# Altium schematic sheet Schematic.SchDoc: PCB_Winch
size A4; DrawnBy: Andres Tosca; Revision: 4
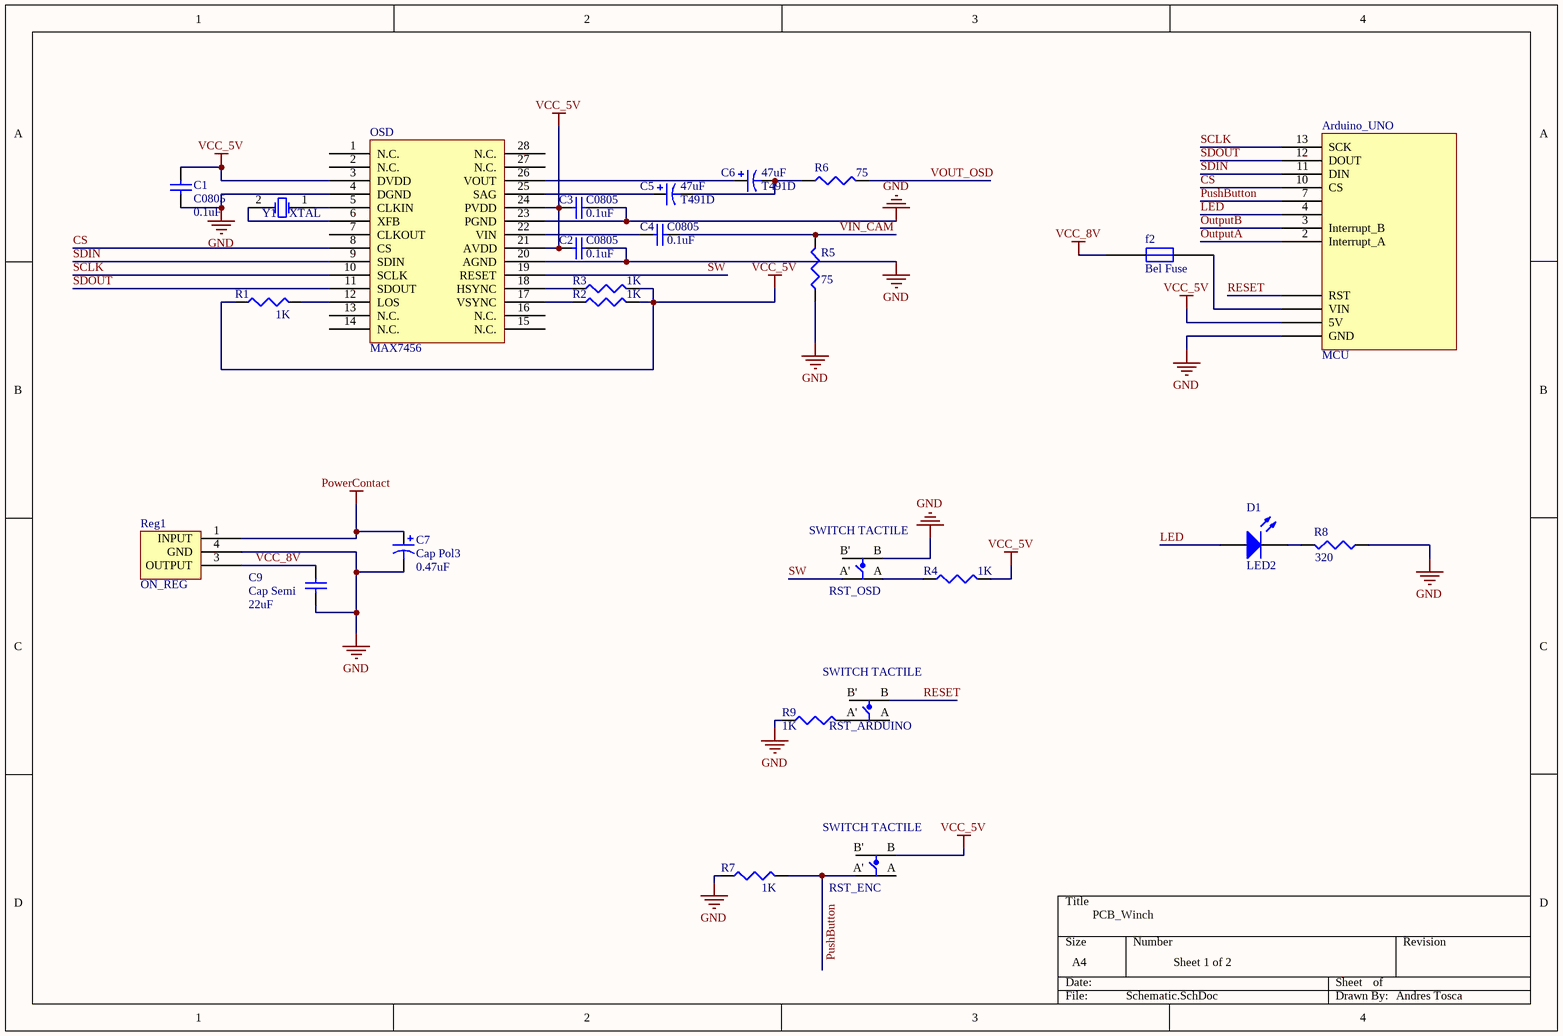
[diagram p0: Schematic.SchDoc]

## Parts
Arduino_UNO  MCU  [MCU]
C1  C0805  value 0.1uF  [CAP_KEMET0.1UF]
C2  C0805  value 0.1uF  [CAP_KEMET0.1UF]
C3  C0805  value 0.1uF  [CAP_KEMET0.1UF]
C4  C0805  value 0.1uF  [CAP_KEMET0.1UF]
C5  T491D  value 47uF  [CAP_Kemet47UF]
C6  T491D  value 47uF  [CAP_Kemet47UF]
C7  Cap Pol3  value 0.47uF  [C0805]
C9  Cap Semi  value 22uF  [CAP_KEMET22UF]
D1  LED2  [3.2X1.6X1.1]
f2  Bel Fuse  [Bel_Fuse]
OSD  MAX7456
R1  value 1K  [RESC2012]  (hidden comment: Res3)
R2  value 1K  [RESC2012]  (hidden comment: Res3)
R3  value 1K  [RESC2012]  (hidden comment: Res3)
R4  value 1K  [RESC2012]  (hidden comment: Res3)
R5  value 75  [RESC2012]  (hidden comment: Res3)
R6  value 75  [RESC2012]  (hidden comment: Res3)
R7  value 1K  [RESC2012]  (hidden comment: Res3)
R8  value 320  [RESC2012]  (hidden comment: Res3)
R9  value 1K  [RESC2012]  (hidden comment: Res3)
Reg1  ON_REG  [SOT223_LM2940]
RST_ARDUINO  SWITCH TACTILE  [Switch tactile]
RST_ENC  SWITCH TACTILE  [Switch tactile]
RST_OSD  SWITCH TACTILE  [Switch tactile]
Y1  XTAL  [ABM3-27.000MHZ-D2Y-T]

## Nets
GND: Arduino_UNO.GND C1.2 C2.2 C3.2 C7.2 C9.1 OSD.4(DGND) OSD.20(AGND) OSD.23(PGND) R5.1 R7.1 R8.1 R9.1 Reg1.4(GND) RST_OSD.B
PowerContact: C7.1 Reg1.1(INPUT)
VCC_5V: Arduino_UNO.5V C1.1 C2.1 C3.1 OSD.3(DVDD) OSD.21(AVDD) OSD.24(PVDD) R1.1 R2.2 R3.2 R4.2 RST_ENC.B
VCC_8V: C9.2 f2.1 Reg1.3(OUTPUT)
CS: Arduino_UNO.10(CS) OSD.8(CS)
LED: Arduino_UNO.4(LED) D1.1(A)
OutputA: Arduino_UNO.2(Interrupt_A)
OutputB: Arduino_UNO.3(Interrupt_B)
PushButton: Arduino_UNO.7(VIN) R7.2 RST_ENC.A'
RESET: Arduino_UNO.RST RST_ARDUINO.B
SCLK: Arduino_UNO.13(SCK) OSD.10(SCLK)
SDIN: Arduino_UNO.11(DIN) OSD.9(SDIN)
SDOUT: Arduino_UNO.12(DOUT) OSD.11(SDOUT)
SW: OSD.19(RESET) RST_OSD.A'
VIN_CAM: C4.2 R5.2
VOUT_OSD: R6.2
NetArduino_UNO_VIN: Arduino_UNO.VIN f2.2
NetC4_1: C4.1 OSD.22(VIN)
NetC5_1: C5.1 OSD.25(SAG)
NetC5_2: C5.2 C6.2 R6.1
NetC6_1: C6.1 OSD.26(VOUT)
NetD1_2: D1.2(K) R8.2
NetOSD_5: OSD.5(CLKIN) Y1.1(OSC1)
NetOSD_6: OSD.6(XFB) Y1.2(OSC2)
NetOSD_12: OSD.12(LOS) R1.2
NetOSD_17: OSD.17(VSYNC) R2.1
NetOSD_18: OSD.18(HSYNC) R3.1
NetR4_1: R4.1 RST_OSD.A
NetR9_2: R9.2 RST_ARDUINO.A'

Not connected (* = marked no-connect by the designer): OSD 1(N.C.) 2(N.C.) 7(CLKOUT) 13(N.C.) 14(N.C.) 15(N.C.) 16(N.C.) 27(N.C.) 28(N.C.); RST_ARDUINO A B'; RST_ENC A B'; RST_OSD B'

## Notes on the sheet
- Sheet 1 of 2

## Library data of the parts
C1-C4 = C0805: Ceramic Chip Capacitor - Standard; Note: Footprint corresponds to dimensions for bulk cassette packaging. This case size has tightened tolerances.; Published: 17-Jul-2002; LatestRevisionDate: 19-Mar-2004; LatestRevisionNote: Silkscreen size reduced.; DatasheetDocument: Mar-2001; PackageDocument: Mar-2001; PackageReference: 0805; Publisher: Altium Limited; Code_JEITA: 0805; Code_IPC: 2012[0805]; ComponentLink1Description: Manufacturer Link; ComponentLink1URL: http://www.kemet.com/; ComponentLink2Description: Datasheet; ComponentLink2URL: http://www.kemet.com/kemet/web/homepage/kechome.nsf/vapubfilesname/F3102TA.pdf/$file/F3102TA.pdf
C5 C6 = T491D: Solid Tantalum Chip Capacitor, Standard T491 Series - Industrial Grade; Published: 17-Jul-2002; LatestRevisionDate: 19-Mar-2004; LatestRevisionNote: Silkscreen dimensions re-sized.; DatasheetDocument: Mar-2001; PackageDocument: Mar-2001; PackageReference: D; Publisher: Altium Limited; Code_JEITA: 7343-31; ComponentLink1Description: Manufacturer Link; ComponentLink1URL: http://www.kemet.com/; ComponentLink2Description: Datasheet; ComponentLink2URL: http://www.kemet.com/kemet/web/homepage/kechome.nsf/vapubfilesname/F3102TA.pdf/$file/F3102TA.pdf
C7 = Cap Pol3: Polarized Capacitor (Surface Mount); Published: 8-Jun-2000; LatestRevisionDate: 29-May-2009; LatestRevisionNote: IPC-7351 Footprint Added.; PackageReference: C0805; Publisher: Altium Limited; PackageDescription: Chip Capacitor
C9 = Cap Semi: Capacitor (Semiconductor SIM Model); Published: 8-Jun-2000; LatestRevisionDate: 29-May-2009; LatestRevisionNote: IPC-7351 Footprint Added.; PackageReference: C1206; Publisher: Altium Limited; PackageDescription: Chip Capacitor
D1 = LED2: Typical RED, GREEN, YELLOW, AMBER GaAs LED; Published: 8-Jun-2000; LatestRevisionDate: 17-Jul-2002; LatestRevisionNote: Re-released for DXP Platform.; PackageVersion: Feb-2002; PackageReference: 3.2X1.6X1.1; Publisher: Altium Limited; PackageDescription: SM LED; 2 Flat Leads
R1-R9 = Res3: Resistor; Published: 8-Jun-2000; LatestRevisionDate: 29-May-2009; LatestRevisionNote: IPC-7351 Footprint Added.; PackageReference: J1-0603; Publisher: Altium Limited; PackageDescription: Chip Resistor
Y1 = XTAL: Crystal Oscillator; Published: 8-Jun-2000; LatestRevisionDate: 17-Jul-2002; LatestRevisionNote: Re-released for DXP Platform.; PackageReference: R38; Publisher: Altium Limited; PackageDescription: Crystal, Thru-Hole; 2 Leads; Body 3.1 x 8.2 mm (Dia.xH)